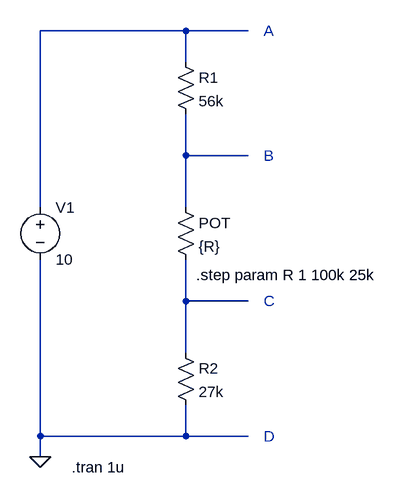
[diagram p0: schematic lab1_3.asc]
lab1_3.asc, the LTspice schematic file:
Version 4
SHEET 1 880 680
WIRE 128 -432 -96 -432
WIRE 224 -432 128 -432
WIRE 128 -384 128 -432
WIRE 128 -240 128 -304
WIRE 224 -240 128 -240
WIRE -96 -160 -96 -432
WIRE 128 -160 128 -240
WIRE 128 -16 128 -80
WIRE 224 -16 128 -16
WIRE 128 64 128 -16
WIRE -96 192 -96 -80
WIRE 128 192 128 144
WIRE 128 192 -96 192
WIRE 224 192 128 192
WIRE -96 224 -96 192
FLAG -96 224 0
SYMBOL res 112 -400 R0
SYMATTR InstName R1
SYMATTR Value 56k
SYMBOL voltage -96 -176 R0
WINDOW 123 0 0 Left 0
WINDOW 39 0 0 Left 0
SYMATTR InstName V1
SYMATTR Value 10
SYMBOL res 112 -176 R0
SYMATTR InstName POT
SYMATTR Value {R}
SYMBOL res 112 48 R0
SYMATTR InstName R2
SYMATTR Value 27k
TEXT 248 -432 Left 2 ;A
TEXT 248 -240 Left 2 ;B
TEXT 248 -16 Left 2 ;C
TEXT 248 192 Left 2 ;D
TEXT 144 -56 Left 2 !.step param R 1 100k 25k
TEXT -48 240 Left 2 !.tran 1u

The netlist it stands for:
* lab1_3.asc
R1 N001 N002 56k
V1 N001 0 10
R§POT N002 N003 {R}
R2 N003 0 27k
* A
* B
* C
* D
.step param R 1 100k 25k
.tran 1u
.backanno
.end